# EAGLE board Pirxboard (EAGLE 6.4)
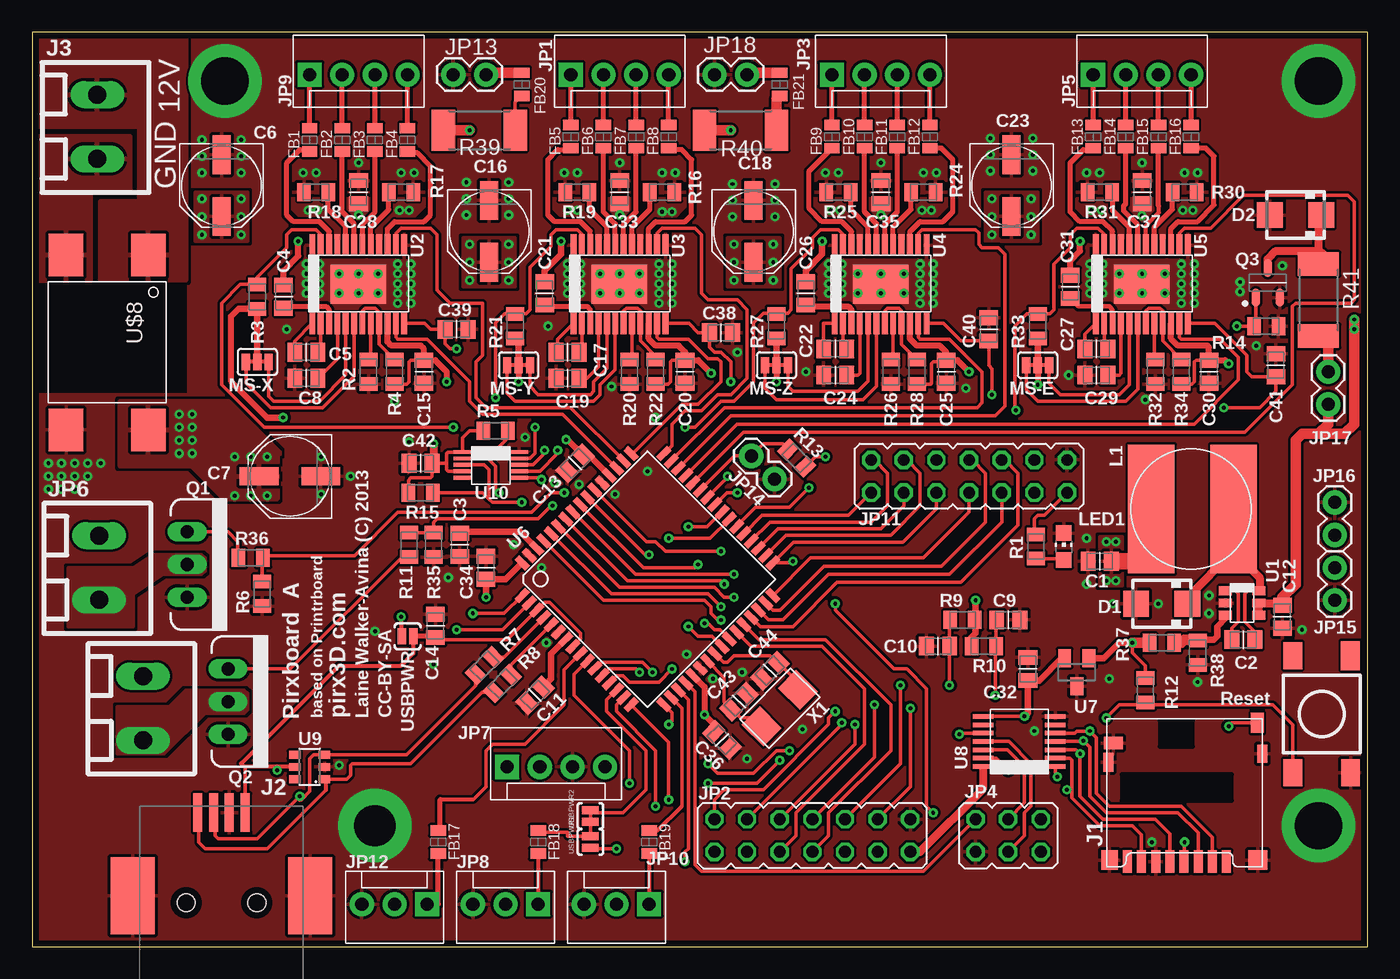
[diagram p1: board, top side]
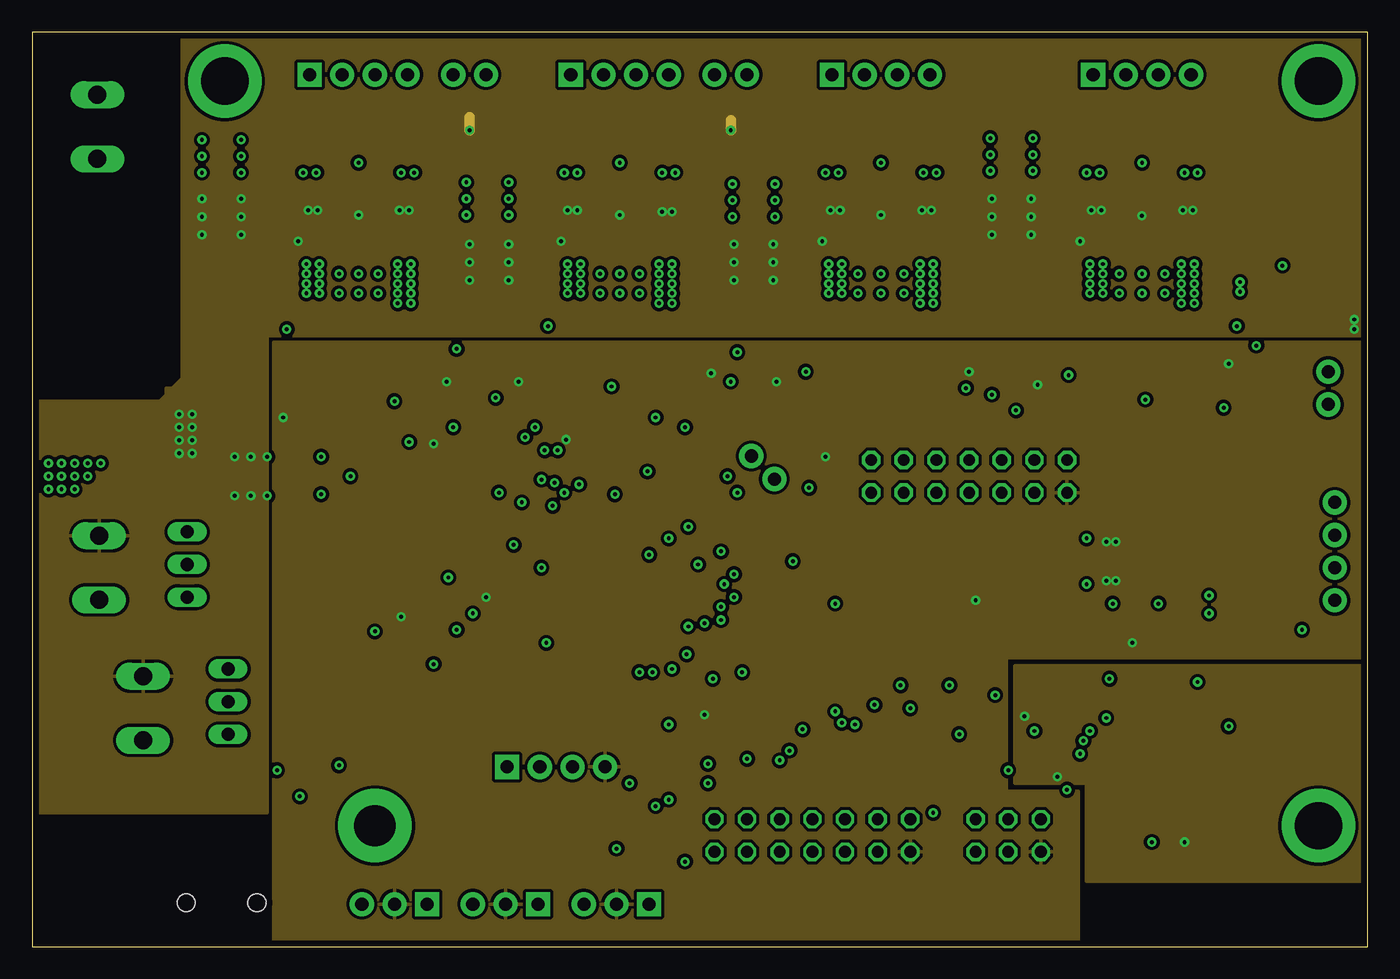
[diagram p2: board, inner layer PWR]
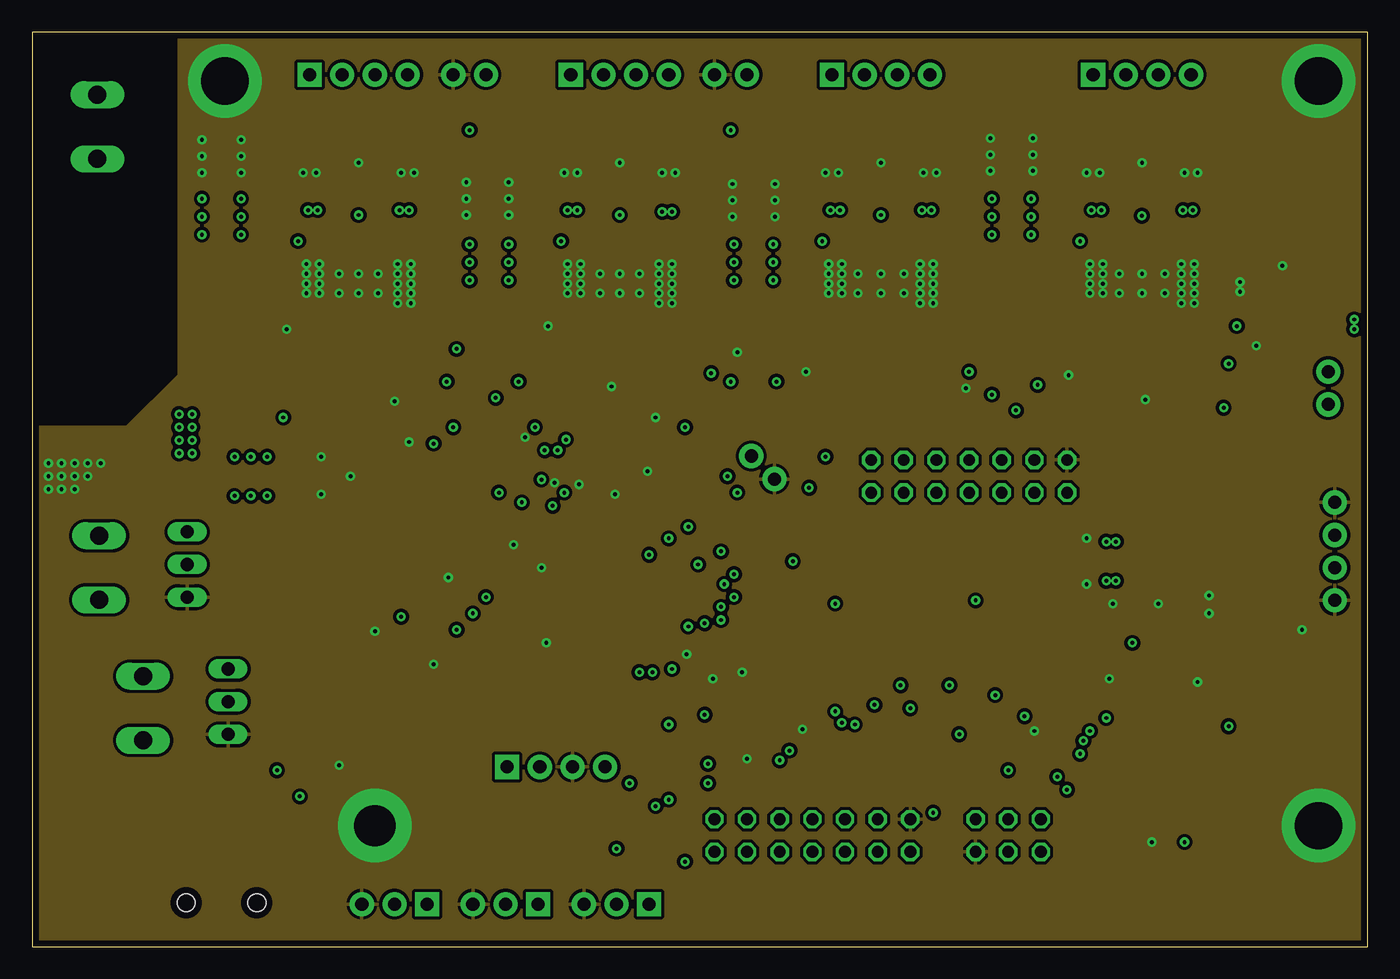
[diagram p3: board, inner layer GND]
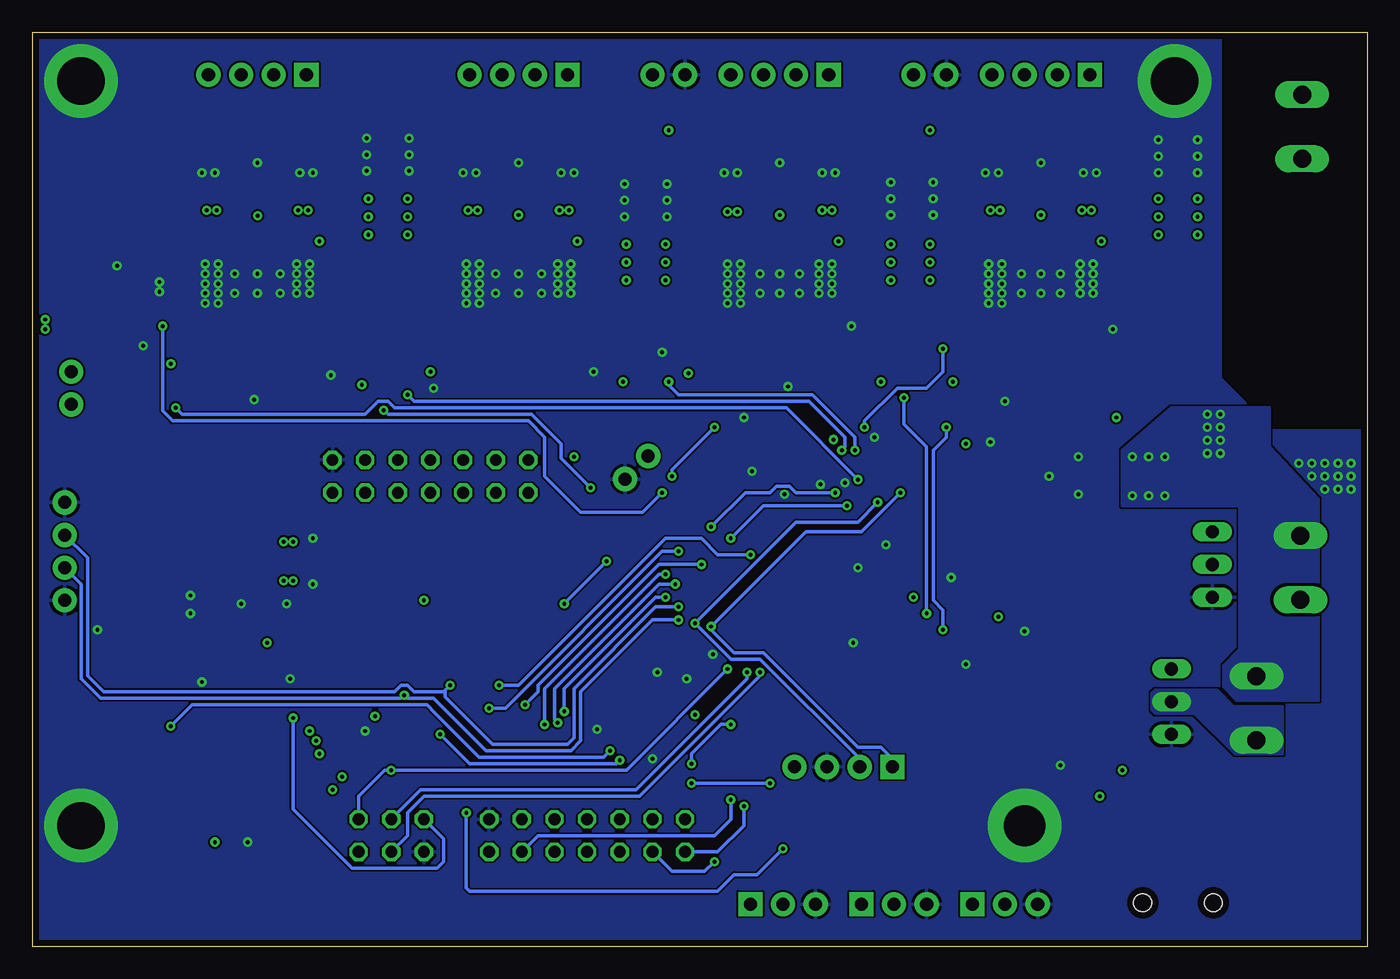
[diagram p4: board, bottom side, seen from below]

Size 103.89 x 71.12 mm. Coordinates in mm from the lower left corner, seen from the top.
Outline: 0,71.12 0,0 103.89,0 103.89,71.12 0,71.12
Copper layers (1*2+3*16): Top 0.035mm / dielectric 0.6mm / PWR 0.035mm / dielectric 0.2mm / GND 0.035mm / dielectric 0.6mm / Bottom 0.035mm
Design rules "default": minimum track width 6mil, minimum drill 12mil, track to track 6mil, track to pad 7mil, pad to pad 6mil, via to via 6mil, smd to smd 0mil, copper to edge 20mil, drill to drill 10mil, minimum pad ring 10mil, minimum via ring 8mil, stop-mask expansion 2mil, vias tented up to drill 100mil, thermal gap 10mil

## Footprints (pad centres in the part's own frame; a part is rotated, then mirrored left to right if it is on the bottom)
CAPC2012X145AN = smd 1.15 x 1.45: 1 -0.9,0; 2 0.9,0
PANASONIC_D = smd 3 x 1.4: + 2.4,0; - -2.4,0
SMA = smd 2 x 2: A 2,0; C -2,0
FB2012 = smd 0.8 x 1.2: P$1 -0.9,0; P$2 0.9,0
AMPHENOL-MICROSD = smd 0.7 x 1.75: 1 3.636,-5.842; 2 2.536,-5.842; 3 1.436,-5.842; 4 0.336,-5.842; 5 -0.764,-5.842; 6 -1.864,-5.842; 7 -2.964,-5.842; 8 -4.064,-5.842 | smd 1.29 x 1.5: C1 -5.464,-5.717 | smd 1.5 x 1.5: C2 6.086,-5.717 | smd 0.8 x 1.5: C3 -5.539,1.883 | smd 0.8 x 1.4: C4 6.436,2.533 | smd 1.5 x 1: CD1 -5.164,3.383 | smd 1 x 1.55: CD2 6.036,4.958
PHOENIX-5MM-2POS = drill 1.4 long: P$1 -2.5,0; P$2 2.5,0
MOLEX-1X4 = drill 1.016 pad 1.88 square: 1 0,0 | drill 1.016 pad 1.88: 2 2.54,0; 3 5.08,0; 4 7.62,0
JP7Q = drill 0.914 octagon: 1 -7.62,-1.27; 2 -7.62,1.27; 3 -5.08,-1.27; 4 -5.08,1.27; 5 -2.54,-1.27; 6 -2.54,1.27; 7 0,-1.27; 8 0,1.27; 9 2.54,-1.27; 10 2.54,1.27; 11 5.08,-1.27; 12 5.08,1.27; 13 7.62,-1.27; 14 7.62,1.27
JP3Q = drill 0.914 octagon: 1 -2.54,-1.27; 2 -2.54,1.27; 3 0,-1.27; 4 0,1.27; 5 2.54,-1.27; 6 2.54,1.27
MOLEX-1X3 = drill 1.016 pad 1.88 square: 1 0,0 | drill 1.016 pad 1.88: 2 2.54,0; 3 5.08,0
1X02 = drill 1.016 pad 1.88: 1 0,0; 2 2.54,0
SDR1006 = smd 10.008 x 3.607: P$1 0,3.048; P$2 0,-3.353
CHIP-LED0805 = smd 1.2 x 1.2: A 0,-1.05; C 0,1.05
SJ_3_CONNECTED = smd 0.635 x 1.27: 1 -0.889,0; 2 0,0; 3 0.889,0
TO220V = drill 1.016 long: 1 -2.54,0; 2 0,0; 3 2.54,0
SOT95P280X135-3N = smd 1.4 x 0.65: 1 -1.15,0.95; 2 -1.15,-0.95; 3 1.15,0
RESC2012X70N = smd 1.05 x 1.4: 1 -0.95,0; 2 0.95,0
R2512 = smd 1.8 x 3.2: 1 -2.8,0; 2 2.8,0
TACTILE_SWITCH_TALL = smd 2.1 x 1.45: A1 -4.55,-2.25; A2 4.55,-2.25; B2 4.55,2.25 | smd 2.25 x 1.45: B1 -4.55,2.225
TSOT6 = smd 0.69 x 1: 1 -1,-1.4; 2 -0.05,-1.4; 3 0.9,-1.4; 4 0.9,1.2; 5 -0.05,1.2; 6 -1,1.2
TSSOP-24 = smd 0.45 x 1.65: 1 -3.6,-3.1; 2 -2.95,-3.1; 3 -2.3,-3.1; 4 -1.65,-3.1; 5 -1,-3.1; 6 -0.35,-3.1; 7 0.3,-3.1; 8 0.95,-3.1; 9 1.6,-3.1; 10 2.25,-3.1; 11 2.9,-3.1; 12 3.55,-3.1; 13 3.55,3; 14 2.9,3; 15 2.25,3; 16 1.6,3; 17 0.95,3; 18 0.3,3; 19 -0.35,3; 20 -1,3; 21 -1.65,3; 22 -2.3,3; 23 -2.95,3; 24 -3.6,3 | smd 4.32 x 3: PAD -0.025,-0.05
TQFP64-2 = smd 1.194 x 0.508: 1 -7.8,6; 2 -7.8,5.2; 3 -7.8,4.4; 4 -7.8,3.6; 5 -7.8,2.8; 6 -7.8,2; 7 -7.8,1.2; 8 -7.8,0.4; 9 -7.8,-0.4; 10 -7.8,-1.2; 11 -7.8,-2; 12 -7.8,-2.8; 13 -7.8,-3.6; 14 -7.8,-4.4; 15 -7.8,-5.2; 16 -7.8,-6; 33 7.8,-6; 34 7.8,-5.2; 35 7.8,-4.4; 36 7.8,-3.6; 37 7.8,-2.8; 38 7.8,-2; 39 7.8,-1.2; 40 7.8,-0.4; 41 7.8,0.4; 42 7.8,1.2; 43 7.8,2; 44 7.8,2.8; 45 7.8,3.6; 46 7.8,4.4; 47 7.8,5.2; 48 7.8,6 | smd 0.508 x 1.194: 17 -6,-7.8; 18 -5.2,-7.8; 19 -4.4,-7.8; 20 -3.6,-7.8; 21 -2.8,-7.8; 22 -2,-7.8; 23 -1.2,-7.8; 24 -0.4,-7.8; 25 0.4,-7.8; 26 1.2,-7.8; 27 2,-7.8; 28 2.8,-7.8; 29 3.6,-7.8; 30 4.4,-7.8; 31 5.2,-7.8; 32 6,-7.8; 49 6,7.8; 50 5.2,7.8; 51 4.4,7.8; 52 3.6,7.8; 53 2.8,7.8; 54 2,7.8; 55 1.2,7.8; 56 0.4,7.8; 57 -0.4,7.8; 58 -1.2,7.8; 59 -2,7.8; 60 -2.8,7.8; 61 -3.6,7.8; 62 -4.4,7.8; 63 -5.2,7.8; 64 -6,7.8
SOT23C = smd 1 x 1.4: 1 -0.95,-1.1; 2 0.95,-1.1; 3 0,1.1
TSSOP14 = smd 0.35 x 1.6: 1 -2,-2.9; 2 -1.35,-2.9; 3 -0.7,-2.9; 4 -0.05,-2.9; 5 0.6,-2.9; 6 1.25,-2.9; 7 1.9,-2.9; 8 1.9,2.7; 9 1.25,2.7; 10 0.6,2.7; 11 -0.05,2.7; 12 -0.7,2.7; 13 -1.35,2.7; 14 -2,2.7
SOT23-6 = smd 0.6 x 0.9: 1 -0.95,-1.15; 2 0,-1.15; 3 0.95,-1.15; 4 0.95,1.15; 5 0,1.15; 6 -0.95,1.15
MSOP10 = smd 0.3 x 1.4: 1 -1,-2.2; 2 -0.5,-2.2; 3 0,-2.2; 4 0.5,-2.2; 5 1,-2.2; 6 1,2.2; 7 0.5,2.2; 8 0,2.2; 9 -0.5,2.2; 10 -1,2.2
ACM1513 = smd 3.3 x 2.7: P$1 -6.8,3.2; P$2 -6.8,-3.2; P$3 6.8,-3.2; P$4 6.8,3.2
TECONECTIVITYUSBBSMT = smd 3 x 0.7: + -16,1.85; - -16,0.6; D+ -16,-1.85; D- -16,-0.6 | smd 6 x 3.4: P$5 -9.55,6.9; P$6 -9.55,-6.9 | hole 1.4: -9,2.75; -9,-2.75
SJ_2S-NO = smd 0.635 x 1.27: 1 -0.45,0; 2 0.45,0
NDK-XTAL = smd 2 x 2.4: P$1 -2,0; P$2 2,0

## Placement (x,y rotation side)
C1  22uF  [CAPC2012X145AN]  83.06,29.97 180 top
C2  0.22uF  [CAPC2012X145AN]  94.23,23.88 180 top
C3  0.1uF  [CAPC2012X145AN]  33.27,31.24 270 top
C4  0.1uF  [CAPC2012X145AN]  19.56,50.55 270 top
C5  0.1uF  [CAPC2012X145AN]  21.34,46.23 180 top
C6  100uF  [PANASONIC_D]  14.73,59.18 270 top
C7  100uF  [PANASONIC_D]  20.07,36.58 180 top
C8  0.22uF  [CAPC2012X145AN]  21.34,44.2 0 top
C9  10uF  [CAPC2012X145AN]  75.95,25.4 180 top
C10  10uF  [CAPC2012X145AN]  70.48,23.37 0 top
C11  1uF  [CAPC2012X145AN]  39.12,19.56 45 top
C12  1uF  [CAPC2012X145AN]  97.28,25.65 270 top
C13  0.1uF  [CAPC2012X145AN]  42.24,37.59 45 top
C14  0.1uF  [CAPC2012X145AN]  31.37,24.95 90 top
C15  10uF  [CAPC2012X145AN]  30.48,44.7 90 top
C16  100uF  [PANASONIC_D]  35.56,55.63 270 top
C17  0.1uF  [CAPC2012X145AN]  41.66,46.23 180 top
C18  100uF  [PANASONIC_D]  56.13,55.63 270 top
C19  0.22uF  [CAPC2012X145AN]  41.66,44.2 0 top
C20  10uF  [CAPC2012X145AN]  50.8,44.7 90 top
C21  0.1uF  [CAPC2012X145AN]  39.88,50.8 270 top
C22  0.1uF  [CAPC2012X145AN]  62.48,46.48 180 top
C23  100uF  [PANASONIC_D]  76.2,59.18 270 top
C24  0.22uF  [CAPC2012X145AN]  62.48,44.45 0 top
C25  10uF  [CAPC2012X145AN]  71.12,44.7 90 top
C26  0.1uF  [CAPC2012X145AN]  60.2,50.8 270 top
C27  0.1uF  [CAPC2012X145AN]  82.8,46.48 180 top
C28  0.1uF  [CAPC2012X145AN]  25.4,58.67 90 top
C29  0.22uF  [CAPC2012X145AN]  82.8,44.45 0 top
C30  10uF  [CAPC2012X145AN]  91.57,44.7 90 top
C31  0.1uF  [CAPC2012X145AN]  80.77,51.31 270 top
C32  10uF  [CAPC2012X145AN]  77.47,21.59 90 top
C33  0.1uF  [CAPC2012X145AN]  45.72,58.67 90 top
C34  0.1uF  [CAPC2012X145AN]  35.31,29.46 270 top
C35  0.1uF  [CAPC2012X145AN]  66.04,58.67 90 top
C36  0.1uF  [CAPC2012X145AN]  53.67,16.08 135 top
C37  0.1uF  [CAPC2012X145AN]  86.36,58.67 90 top
C38  0.1uF  [CAPC2012X145AN]  53.59,47.75 0 top
C39  0.1uF  [CAPC2012X145AN]  33.02,48.01 0 top
C40  0.1uF  [CAPC2012X145AN]  74.42,48.01 90 top
C41  0.1uF  [CAPC2012X145AN]  96.77,45.21 90 top
C42  0.1uF  [CAPC2012X145AN]  30.23,37.59 0 top
C43  10pF  [CAPC2012X145AN]  54.99,19.05 225 top
C44  10pF  [CAPC2012X145AN]  57.4,21.46 45 top
D1  [SMA]  87.88,26.67 180 top
D2  [SMA]  98.3,56.9 180 top
FB1  MPZ2012  [FB2012]  21.59,62.74 90 top
FB2  MPZ2012  [FB2012]  24.13,62.74 90 top
FB3  MPZ2012  [FB2012]  26.67,62.74 90 top
FB4  MPZ2012  [FB2012]  29.21,62.74 90 top
FB5  MPZ2012  [FB2012]  41.91,62.99 90 top
FB6  MPZ2012  [FB2012]  44.45,62.99 90 top
FB7  MPZ2012  [FB2012]  46.99,62.99 90 top
FB8  MPZ2012  [FB2012]  49.53,62.99 90 top
FB9  MPZ2012  [FB2012]  62.23,62.99 90 top
FB10  MPZ2012  [FB2012]  64.77,62.99 90 top
FB11  MPZ2012  [FB2012]  67.31,62.99 90 top
FB12  MPZ2012  [FB2012]  69.85,62.99 90 top
FB13  MPZ2012  [FB2012]  82.55,62.99 90 top
FB14  MPZ2012  [FB2012]  85.09,62.99 90 top
FB15  MPZ2012  [FB2012]  87.63,62.99 90 top
FB16  MPZ2012  [FB2012]  90.17,62.99 90 top
FB17  MPZ2012  [FB2012]  31.6,8.13 270 top
FB18  MPZ2012  [FB2012]  39.37,8.13 270 top
FB19  MPZ2012  [FB2012]  48.01,8.13 270 top
FB20  MPZ2012  [FB2012]  38.1,67.06 90 top
FB21  MPZ2012  [FB2012]  58.17,67.06 90 top
J1  MICROSD  [AMPHENOL-MICROSD]  89.28,12.45 0 top
J2  [PHOENIX-5MM-2POS]  8.64,18.54 270 top
J3  [PHOENIX-5MM-2POS]  5.08,63.75 270 top
JP1  MOT-Y  [MOLEX-1X4]  41.91,67.82 0 top
JP2  EXP1  [JP7Q]  60.71,8.64 0 top
JP3  MOT-Z  [MOLEX-1X4]  62.23,67.82 0 top
JP4  ICSP  [JP3Q]  75.95,8.64 0 top
JP5  MOT-E  [MOLEX-1X4]  82.55,67.82 0 top
JP6  [PHOENIX-5MM-2POS]  5.21,29.46 270 top
JP7  I2C  [MOLEX-1X4]  36.96,13.97 0 top
JP8  Y-STOP  [MOLEX-1X3]  39.37,3.3 180 top
JP9  MOT-X  [MOLEX-1X4]  21.59,67.82 0 top
JP10  Z-STOP  [MOLEX-1X3]  48.01,3.3 180 top
JP11  EXP2  [JP7Q]  72.9,36.58 180 top
JP12  X-STOP  [MOLEX-1X3]  30.73,3.3 180 top
JP13  LED  [1X02]  35.31,67.82 180 top
JP14  BOOT  [1X02]  57.75,36.36 135 top
JP15  B-THERM  [1X02]  101.35,29.46 270 top
JP16  E-THERM  [1X02]  101.35,32 90 top
JP17  FAN  [1X02]  100.84,42.16 90 top
JP18  EFAN  [1X02]  55.63,67.82 180 top
L1  47uH  [SDR1006]  90.42,34.04 270 top
LED1  PWR  [CHIP-LED0805]  80.26,31.12 0 top
MS-E  [SJ_3_CONNECTED]  78.23,45.21 180 top
MS-X  [SJ_3_CONNECTED]  17.53,45.47 180 top
MS-Y  [SJ_3_CONNECTED]  37.85,45.21 180 top
MS-Z  [SJ_3_CONNECTED]  57.91,45.21 180 top
Q1  RFP30N06LE  [TO220V]  12.07,29.72 270 top
Q2  RFP30N06LE  [TO220V]  15.24,19.05 270 top
Q3  RFP30N06LE  [SOT95P280X135-3N]  96.14,51.63 90 top
R1  330  [RESC2012X70N]  78.11,31.12 90 top
R2  10k  [RESC2012X70N]  26.16,44.7 270 top
R3  100k  [RESC2012X70N]  17.53,50.55 90 top
R4  100k  [RESC2012X70N]  28.19,44.7 90 top
R5  4.7k  [RESC2012X70N]  36.07,40.13 180 top
R6  100k  [RESC2012X70N]  17.91,27.43 270 top
R7  22  [RESC2012X70N]  35.18,21.84 45 top
R8  22  [RESC2012X70N]  36.58,20.45 45 top
R9  4.7k  [RESC2012X70N]  72.39,25.4 0 top
R10  4.7k  [RESC2012X70N]  74.04,23.37 180 top
R11  47r  [RESC2012X70N]  29.34,31.24 270 top
R12  100k  [RESC2012X70N]  86.61,19.94 90 top
R13  100k  [RESC2012X70N]  59.48,37.99 315 top
R14  100k  [RESC2012X70N]  96.01,48.26 0 top
R15  4.7k  [RESC2012X70N]  30.23,35.31 180 top
R16  0.11  [RESC2012X70N]  49.02,58.67 0 top
R17  0.11  [RESC2012X70N]  28.7,58.67 0 top
R18  0.11  [RESC2012X70N]  22.1,58.67 180 top
R19  0.11  [RESC2012X70N]  42.42,58.67 180 top
R20  10k  [RESC2012X70N]  46.48,44.7 270 top
R21  100k  [RESC2012X70N]  37.59,48.26 90 top
R22  100k  [RESC2012X70N]  48.51,44.7 90 top
R24  0.11  [RESC2012X70N]  69.34,58.67 0 top
R25  0.11  [RESC2012X70N]  62.74,58.67 180 top
R26  10k  [RESC2012X70N]  66.8,44.7 270 top
R27  100k  [RESC2012X70N]  57.91,48.26 90 top
R28  100k  [RESC2012X70N]  68.83,44.7 90 top
R30  0.11  [RESC2012X70N]  89.66,58.67 0 top
R31  0.11  [RESC2012X70N]  83.06,58.67 180 top
R32  10k  [RESC2012X70N]  87.38,44.7 270 top
R33  100k  [RESC2012X70N]  78.23,48.26 90 top
R34  100k  [RESC2012X70N]  89.41,44.7 90 top
R35  100k  [RESC2012X70N]  31.24,31.24 270 top
R36  100  [RESC2012X70N]  17.02,30.23 180 top
R37  5.6k  [RESC2012X70N]  87.88,23.62 0 top
R38  1k  [RESC2012X70N]  90.68,22.86 270 top
R39  47r  [R2512]  34.8,63.5 0 top
R40  45r  [R2512]  55.12,63.5 0 top
R41  10  [R2512]  100.08,50.29 270 top
S1  Reset  [TACTILE_SWITCH_TALL]  100.33,18.08 270 top
U1  LM2841  [TSOT6]  94.23,26.67 270 top
U2  A4982  [TSSOP-24]  25.4,51.56 0 top
U3  A4982  [TSSOP-24]  45.72,51.56 0 top
U4  A4982  [TSSOP-24]  66.04,51.56 0 top
U5  A4982  [TSSOP-24]  86.36,51.56 0 top
U6  AT90USB1286  [TQFP64-2]  47.88,28.58 45 top
U7  AP7313  [SOT23C]  81.28,21.34 180 top
U8  TXB0104  [TSSOP14]  76.71,16 90 top
U9  PRTR5V0U4D  [SOT23-6]  21.59,13.97 90 top
U10  MCP4728  [MSOP10]  35.69,37.46 270 top
U$8  ACM1513-551-2PLACM1513  [ACM1513]  5.84,46.99 270 top
U$12  USB_B_SMT_TECONNECTIVITY  [TECONECTIVITYUSBBSMT]  14.73,-5.59 270 top
USBPWR  [SJ_2S-NO]  29.21,24.13 180 top
USBPWR1  [SJ_2S-NO]  43.43,8.13 90 top
USBPWR2  [SJ_2S-NO]  43.43,10.16 90 top
X1  16MHz  [NDK-XTAL]  58.17,18.54 225 top

## Tracks (layer width: path | path; a pad name or v marks a point on that pad's centre or on a via)
12V  (via drill 0.3, 0.3 pad 0.41)
  Top 0.254: 97.28,26.42 C12.1 97.28,26.67
  Top 0.457: C4.1 19.56,52.58 20.7,53.72 v20.7,54.86 | C31.1 80.77,53.34 81.53,54.1 v81.53,54.86
  Top 0.508: C31.1 80.38,52.21 | 40.25,51.7 C21.1 39.88,52.58 41.15,53.85 v41.15,54.86 | v61.47,54.86 61.47,53.85 60.2,52.58 C26.1
  Top 0.61: U1.4 U1.5 97.11,26.72 C12.1
  Top 0.813: v102.87,48.77 102.87,40.64 102.11,39.88 100.08,39.88 | C12.1 97.28,26.67 97.28,27.18 98.3,28.19 98.3,39.37 98.81,39.88 100.08,39.88 | JP17.1 100.84,40.64 100.08,39.88 | R39.1 v34.04,63.5 | R40.1 v54.36,63.5
  PWR 0.813: v34.04,63.5 34.04,64.52 | v54.36,63.5 54.36,64.26
  other vias: 21.46,57.28 29.34,57.28 41.66,57.28 49.78,57.15 69.98,57.28 86.33,56.85 90.3,57.28 66.04,56.9 45.72,56.9 25.4,56.9 62.1,57.28 82.42,57.28 77.72,58.17 77.72,56.77 77.72,55.37 74.68,58.17 74.68,56.77 74.68,55.37 16.26,58.17 16.26,56.77 16.26,55.37 13.21,58.17 13.21,56.77 13.21,55.37 57.66,54.61 57.66,53.21 57.66,51.82 54.61,54.61 54.61,53.21 54.61,51.82 37.08,54.61 37.08,53.21 37.08,51.82 34.04,54.61 34.04,53.21 34.04,51.82 49.02,57.15 42.42,57.28 22.22,57.28 28.57,57.28 62.87,57.28 69.22,57.28 83.19,57.28 89.53,57.28 102.87,48.01 18.29,38.1 17.02,38.1 15.75,38.1 17.02,35.05 18.29,35.05 15.75,35.05 11.43,41.4 11.43,40.39 11.43,39.37 11.43,38.35 12.45,41.4 12.45,40.39 12.45,39.37 12.45,38.35
  pour Bottom (isolate 0.254, no thermals): 9.91,34.29 19.05,34.29 19.05,38.61 15.24,41.91 7.62,41.91 7.62,38.86 3.81,34.8 3.81,34.8 3.81,19.18 10.16,19.18 11.18,20.19 11.18,21.84 9.91,23.11
  pour PWR (isolate 0.254, rank 6): 103.89,47.5 18.29,47.5 18.29,10.41 0,10.41 0,28.45 0.25,27.43 0.25,42.42 9.91,42.42 11.68,44.2 11.68,71.12 103.89,71.12
  pour Top (no thermals): 82.55,55.12 90.42,55.12 90.42,56.39 91.69,57.66 91.69,58.17 81.28,58.17 81.28,57.4 82.55,56.13
  pour Top (isolate 0.254): 74.42,58.67 78.23,58.67 78.23,54.86 74.17,54.86 74.17,58.67
  pour Top (no thermals): 62.1,55.12 69.98,55.12 69.98,56.39 71.25,57.66 71.25,58.17 60.83,58.17 60.83,57.4 62.1,56.13
  pour Top (no thermals): 41.78,55.12 49.66,55.12 49.66,56.39 50.93,57.66 50.93,58.17 40.51,58.17 40.51,57.4 41.78,56.13
  pour Top (no thermals): 21.46,55.12 29.34,55.12 29.34,56.39 30.61,57.66 30.61,58.17 20.19,58.17 20.19,57.4 21.46,56.13
  pour Top: 12.95,58.67 16.76,58.67 16.76,54.86 12.7,54.86 12.7,58.67
  pour Top (isolate 0.254): 54.1,55.12 58.17,55.12 58.17,51.31 54.1,51.31
  pour Top (isolate 0.254): 33.53,55.12 37.59,55.12 37.59,51.31 33.53,51.31
  pour PWR (isolate 0.254, no thermals): 13.46,43.43 10.41,43.43 10.41,41.66 13.46,41.66
  pour Top: 19.05,34.8 14.99,34.8 12.45,37.34 6.86,37.34 6.86,42.42 15.24,42.42 19.3,38.35 19.05,38.35
!E-ENABLE  (via drill 0.3)
  Top 0.254: v60.45,35.69 58.93,34.16 56.3,34.16 | U5.23 83.41,55.4 82.93,55.88 81.28,55.88 80.77,55.37 80.77,54.36 79.5,53.09 79.5,49.53 79.18,49.21 R33.2 77.4,49.21 76.45,48.26 76.45,41.61 v76.55,41.7 | U6.38 56.3,34.16 | 56.3,34.16
  Bottom 0.254: v60.45,35.69 62.74,37.97 62.74,39.12 65.02,41.4 76.2,41.4 76.5,41.7 v76.55,41.7
!HOTBED  (via drill 0.3)
  Top 0.254: v49.53,31.75 52.75,31.75 U6.39 | R11.1 R35.1 31.24,33.02 31.5,33.27 39.37,33.27 40.38,34.28 v40.5,34.28
  Bottom 0.254: v40.5,34.28 47,34.28 v49.53,31.75
!HOTEND  (via drill 0.3)
  Top 0.254: v51.05,32.64 52.51,32.64 | U6.40 52.51,32.64 | 52.51,32.64 | v41.4,35.31 40.39,35.31 38.86,33.78 28.45,33.78 25.08,30.41 17.97,30.41 R36.1 17.91,30.29 | R6.1 17.91,30.29 | 18.03,30.48 17.91,30.35 17.91,30.29
  Bottom 0.254: v51.05,32.64 48.39,35.31 46.48,35.31 45.97,35.81 44.96,35.81 44.45,35.31 v41.4,35.31
!PWM-FAN  (via drill 0.3)
  Top 0.254: U6.41 | Q3.1 95.19,48.39 R14.1 v93.73,48.26 | U6.41 54.04,35.31 v54.86,35.31
  Bottom 0.254: v93.73,48.26 93.73,41.66 92.96,40.89 65.28,40.89 64.01,39.62 64.01,36.58 61.21,33.78 56.39,33.78 v54.86,35.31
!RESET  (via drill 0.3)
  Top 0.254: 86.61,18.8 84.58,18.8 v83.57,17.78 | 86.61,18.8 96.52,18.8 98.08,17.24 S1.A2 | 86.61,18.8 R12.1 | U6.20 | U6.20 51.56,19.8 51.56,6.35 52.07,5.84 69.34,5.84 JP4.2
  Bottom 0.254: v83.57,17.78 83.57,10.67 78.99,6.1 72.39,6.1 71.88,6.6 71.88,8.38 JP4.2
!X-ENABLE  (via drill 0.3)
  Top 0.254: U2.23 22.45,55.4 22.1,55.75 20.19,55.75 19.81,55.37 19.81,54.36 17.53,52.07 R3.2 16.19,51.5 14.73,50.04 14.73,43.69 18.03,40.39 v32.77,40.39 | v33.02,24.64 36.59,24.64 | U6.2 36.59,24.64 | 36.59,24.64
  Bottom 0.254: v33.02,24.64 33.02,26.16 33.78,26.92 33.78,38.61 32.77,39.62 v32.77,40.39
!Y-ENABLE  (via drill 0.3)
  Top 0.254: U3.23 42.77,55.4 42.42,55.75 40.77,55.75 40.39,55.37 40.39,54.48 38.73,52.83 38.73,49.53 38.41,49.21 R21.2 36.76,49.21 36.07,48.51 v36.07,42.67 | v34.29,25.91 36.73,25.91 U6.1
  Bottom 0.254: v34.29,25.91 34.29,38.86 36.07,40.64 v36.07,42.67
!Z-ENABLE  (via drill 0.3)
  Top 0.254: U4.23 63.09,55.4 62.74,55.75 61.34,55.75 60.71,55.12 60.71,54.36 59.05,52.7 59.05,49.53 58.8,49.28 57.85,49.28 | 57.85,49.28 56.9,49.28 56.13,48.51 56.13,43.94 54.61,42.42 53.59,42.42 51.56,40.39 v50.8,40.39 | 57.85,49.28 R27.2 | U6.42 54.1,36.49 v54.1,36.58
  Bottom 0.254: v50.8,40.39 54.1,37.08 v54.1,36.58
+3V3  (via drill 0.3)
  Top 0.254: U8.1 79.61,13.36 v79.76,13.21 | U8.8 v77.22,17.91 | v89.66,8.13 89.66,6.69 89.62,6.64 J1.4
  Top 0.508: U7.2 80.09,22.44 78.35,20.69 C32.1 77.47,18.16 v77.22,17.91
  pour PWR (isolate 0.254): 103.89,21.84 76.45,21.84 76.45,12.7 82.04,12.7 82.04,5.08 103.89,5.08
+5V  (via drill 0.3)
  Top 0.254: R4.1 29.15,43.75 29.34,43.94 29.34,45.47 29.46,45.59 30.47,45.59 C15.2 | R22.1 49.47,43.75 49.66,43.94 49.66,45.47 49.8,45.6 C20.2 | C25.2 70.98,45.47 70.1,45.47 69.98,45.34 69.98,43.81 69.92,43.75 R28.1 | R34.1 90.24,43.75 90.42,43.94 90.42,45.47 90.56,45.6 C30.2 | R12.2 86.61,21.84 85.6,22.86 v85.6,23.62 | R13.2 60.94,38.1 v61.72,38.1 | 53.14,17.22 53.14,17.07 53.09,17.02 | U10.4 32.38,36.97 32.26,37.08 32.26,37.59 | 32.26,37.59 32.26,38.35 32.37,38.46 U10.1 33.49,39.58 34.04,40.13 R5.2 | 32.26,37.59 C42.2 31.11,37.58 31.11,36.58 30.99,36.45 29.46,36.45 29.28,36.26 R15.2 | U8.14 74.01,13.82 | R1.2 77.98,32.19 77.98,33.27 78.23,33.53 78.74,33.53 JP11.2
  Top 0.305: USBPWR.2 28.76,25.6 v28.7,25.65
  Top 0.406: 53.09,17.02 53.03,17.02 C36.2
  Top 0.457: U2.10 27.65,47.03 27.94,46.74 30.23,46.74 30.48,46.48 C15.2 31.36,45.6 32.26,44.7 v32.26,43.94 | 18.29,41.15 15.49,43.94 15.49,49.02 | U3.10 47.97,47.28 48.51,46.74 50.29,46.74 50.8,46.23 C20.2 51.82,45.6 v52.83,44.59 | MS-Y.2 v37.85,43.94 | U4.10 68.29,47.28 68.83,46.74 70.61,46.74 71.12,46.23 C25.2 72,45.6 v72.9,44.7 | MS-Z.2 v57.91,43.94 | U5.10 88.61,47.28 89.15,46.74 91.44,46.74 91.57,46.61 C30.2 92.83,45.6 v93.09,45.34 | MS-E.2 v78.23,43.69 | U6.21 52.32,20.17 v52.32,18.03 53.14,17.22
  Top 0.508: 15.49,49.02 16.07,49.6 R3.1 MS-X.2 | 18.29,41.15 v19.54,41.15 | MS-Y.2 37.85,47.06 R21.1 | MS-Z.2 R27.1 | MS-E.2 R33.1 | R10.2 73.09,24.07 73.41,24.38 73.41,25.33 R9.2 73.41,25.47 v73.41,26.92 | U7.1 83.4,22.44 84.58,23.62 v85.6,23.62 | U6.64 36.84,28.56 C34.2 v35.31,27.18 | U6.52 43.32,38.23 C13.2 | v41.53,39.43 41.67,39.43 C13.2 | C13.2 42.8,38.23
  Top 0.61: v31.24,39.12 31.24,37.71 C42.2 | JP2.13 69.09,7.37 74.01,12.29 74.01,13.82
  Top 0.813: v85.6,23.62 R37.1
  Top 1.27: C1.1 86.61,29.97 87.12,30.48 87.12,33.98 L1.P$2
  other vias: 83.57,31.5 84.33,31.5 83.57,28.45 84.33,28.45
  pour PWR (isolate 0.254): 103.89,46.99 18.8,46.99 18.8,0 81.41,0 81.41,12.07 75.82,12.07 75.82,22.48 103.89,22.48
  pour Top (isolate 0.254): 84.84,28.07 84.84,31.88 83.06,31.88 83.06,28.07
A2  (via drill 0.3)
  Top 0.254: U6.59 45.69,27.94 53.09,27.94 53.85,27.18 v54.61,27.18 | JP2.2 53.09,11.43 53.85,12.19 56.9,12.19 61.98,17.27 61.98,17.78 v62.48,18.29
  Bottom 0.254: v62.48,18.29 62.48,20.07 55.37,27.18 v54.61,27.18
A3  (via drill 0.3)
  Top 0.254: U6.58 46.31,28.45 53.59,28.45 v53.85,28.19 | JP2.4 62.99,17.27 v62.99,17.4
  Bottom 0.254: v62.99,17.4 63.25,17.65 63.25,20.07 55.12,28.19 v53.85,28.19
ALE
  Top 0.254: U6.43 54.63,38.16 JP14.2 55.95,38.17 56.9,39.12 58.42,39.12 58.93,38.61 58.86,38.61 R13.1
AREF
  Top 0.508: C3.1 33.39,32.26 37.97,32.26 U6.62
B-THERM  (via drill 0.3)
  Top 0.254: v74.93,19.56 74.93,23.31 R10.1 74.99,25.34 C9.2 | U6.61 44.44,26.92 52.32,26.92 52.83,26.42 52.83,25.91 53.34,25.4 v53.59,25.4
  Bottom 0.254: JP15.1 100.08,28.19 100.08,20.83 98.55,19.3 75.18,19.3 v74.93,19.56 74.68,19.3 72.64,19.3 68.58,15.24 61.98,15.24 61.21,16 61.21,19.81 55.63,25.4 v53.59,25.4
E-DIR
  Top 0.254: U5.14 89.26,55.48 89.66,55.88 91.69,55.88 94.23,58.42 102.36,58.42 102.87,57.91 102.87,50.29 102.62,50.04 98.3,50.04 98.04,49.78 98.04,43.69 94.36,40 55.35,40 U6.44
E-STEP
  Top 0.254: U5.11 89.26,47.39 89.41,47.24 92.46,47.24 93.85,45.85 93.85,44.07 90.42,40.64 54.85,40.64 U6.45
E-THERM  (via drill 0.3)
  Top 0.254: v71.37,20.32 71.37,23.36 C10.2 71.39,25.34 R9.1 | U6.60 45.06,27.43 52.58,27.43 v53.59,26.42
  Bottom 0.254: JP16.1 99.57,30.23 99.57,21.08 98.3,19.81 75.69,19.81 75.18,20.32 74.68,20.32 74.17,19.81 71.75,19.81 | v71.37,20.32 71.75,19.94 71.75,19.81 | 71.75,19.81 71.75,19.43 68.07,15.75 62.23,15.75 61.72,16.26 61.72,20.07 55.37,26.42 v53.59,26.42
GND  (via drill 0.3, 3.2 pad 5.71, 3.68 pad 5.71)
  other vias: 40.01,23.62 29.34,39.24 26.67,24.51 32.38,28.7 100.08,9.4 26.67,9.4 14.99,67.31 100.08,67.31 21.08,60.2 29.72,60.2 23.88,52.32 25.4,52.32 26.92,52.32 23.88,50.8 25.4,50.8 26.92,50.8 41.4,60.2 50.04,60.2 82.04,60.2 83.06,60.2 89.66,60.2 90.68,60.2 61.72,60.2 62.74,60.2 69.34,60.2 70.36,60.2 42.42,60.2 49.02,60.2 22.1,60.2 28.7,60.2 44.2,52.32 45.72,52.32 47.24,52.32 47.24,50.8 45.72,50.8 44.2,50.8 61.98,52.32 61.98,51.56 62.99,53.09 62.99,52.32 69.09,52.32 62.99,51.56 83.31,53.09 89.41,52.32 89.41,53.09 83.31,52.32 83.31,51.56 89.41,51.56 19.81,48.01 13.21,61.47 13.21,62.74 16.26,61.47 33.78,56.9 33.78,59.44 33.78,58.17 80.64,44.45 86.61,42.55 40.13,48.26 60.2,44.7 72.64,43.43 48.51,41.15 28.19,42.42 59.94,16.89 50.93,22.73 45.34,35.18 39.62,29.46 16.26,62.74 37.08,59.44 37.08,58.17 37.08,56.9 54.48,56.77 74.55,62.86 13.21,60.2 16.26,60.2 54.48,59.31 54.48,58.04 57.79,59.31 57.79,58.04 57.79,56.77 74.55,61.59 74.55,60.32 77.85,62.86 77.85,61.59 77.85,60.32 97.28,52.96 86.36,60.96 82.3,52.32 82.3,53.09 90.42,53.09 90.42,52.32 66.04,60.96 45.72,60.96 69.09,51.56 69.09,50.8 70.1,51.56 70.1,52.32 70.1,50.8 90.42,51.56 61.98,53.09 69.09,50.04 70.1,50.04 69.09,53.09 70.1,53.09 61.98,50.8 62.99,50.8 25.4,60.96 64.26,52.32 66.04,52.32 67.82,52.32 67.82,50.8 66.04,50.8 64.26,50.8 84.58,52.32 84.58,50.8 86.36,50.8 88.14,50.8 88.14,52.32 86.36,52.32 82.3,51.56 82.3,50.8 83.31,50.8 89.41,50.8 89.41,50.04 90.42,50.8 90.42,50.04 41.66,52.32 41.66,51.56 42.67,53.09 42.67,52.32 42.67,51.56 41.66,53.09 41.66,50.8 42.67,50.8 48.77,53.09 48.77,52.32 48.77,51.56 48.77,50.8 48.77,50.04 49.78,50.04 49.78,50.8 49.78,51.56 49.78,52.32 49.78,53.09 22.35,53.09 21.34,53.09 21.34,52.32 21.34,51.56 21.34,50.8 22.35,50.8 22.35,51.56 22.35,52.32 28.45,53.09 29.46,53.09 29.46,52.32 29.46,51.56 29.46,50.8 29.46,50.04 28.45,50.04 28.45,50.8 28.45,51.56 28.45,52.32 31.24,21.97 23.88,14.1 52.96,20.83 87.12,8.13 77.98,16.76 91.57,25.91 91.57,27.3 84.07,26.67 87.63,26.67 90.68,20.57 98.81,24.64 83.82,20.83 37.47,31.24 55.63,14.61 82.04,31.75 82.04,28.19 95.25,46.74 54.86,46.23 45.09,43.56 42.55,35.94 47.88,36.96 38.35,39.62 40.64,36.07 55.25,21.34 22.48,38.1 22.48,35.18 24.76,36.58 93.98,51.69 93.98,50.93 1.27,37.59 2.29,37.59 3.3,37.59 4.32,37.59 1.27,36.58 2.29,36.58 3.3,36.58 4.32,36.58 1.27,35.56 2.29,35.56 3.3,35.56 5.33,37.59
  pour Top (isolate 0.203, rank 6): 12.19,71.12 103.89,71.12 103.89,0 0.51,0 0.51,42.93 12.19,42.93
  pour Bottom (rank 6): 11.43,71.12 103.89,71.12 103.89,0 0,0 0,40.13 7.37,40.13 11.43,44.2
  pour GND (isolate 0.254): 103.89,71.12 103.89,0 0,0 0,40.39 7.37,40.39 11.43,44.45 11.43,71.12
HOTBED-GND
  pour Top (isolate 0.254, no thermals): 11.94,19.94 16.51,19.94 16.76,19.69 16.76,18.41 16.51,18.16 13.46,18.16 10.29,14.99 6.6,14.99 6.6,18.67 10.67,18.67
  pour Bottom (isolate 0.254, no thermals): 6.6,18.67 10.41,18.67 11.68,19.94 16.51,19.94 16.76,19.69 16.76,18.41 16.51,18.16 13.46,18.16 10.29,14.99 6.6,14.99
HOTEND-GND
  pour Top (isolate 0.254, no thermals): 9.4,30.48 13.21,30.48 13.46,30.23 13.46,29.21 13.21,28.96 10.16,28.96 7.87,27.43 7.87,24.89 2.79,24.89 2.79,29.46 7.87,29.46
MCU_DN  (via drill 0.3)
  Top 0.254: R7.1 34.51,20.28 29.14,14.92 U9.3 21.9,14.92 21.59,14.61 21.59,12.07 20.95,11.43 20.83,11.43 | v20.83,11.68 17.53,8.38 14.48,8.38 14.22,8.64 14.22,10.32 U$12.D-
  Top 0.406: v20.83,11.68 20.83,11.43
MCU_DP
  Top 0.254: U9.1 24.45,13.02 24.76,13.34 24.76,14.1 24.89,14.22 29.46,14.22 35.02,19.77 R8.1 | 22.86,12.19 18.29,7.62 13.46,7.62 12.95,8.13 12.95,10.34 U$12.D+
  Top 0.305: 22.86,12.19 22.86,12.9 U9.1
MISO  (via drill 0.3)
  Top 0.254: U8.13 75.01,14.65 v75.95,13.72 | v49.78,21.59 48.77,20.57 46.48,20.57 45.97,21.08 45.48,21.08 U6.13
  Bottom 0.254: v49.78,21.59 57.66,13.72 v75.95,13.72 76.45,13.72 78.49,11.68 JP4.6
MOSI  (via drill 0.3)
  Top 0.254: U6.12 44.85,21.59 46.99,21.59 v47.24,21.34 | U8.11 76,15.95 77.72,14.22 77.72,10.92 77.22,10.41 77.22,8.64 JP4.3
  Bottom 0.254: v47.24,21.34 47.24,21.08 56.64,11.68 73.41,11.68 74.68,10.41 74.68,8.64 JP4.3
N$1
  Top 0.254: R1.1 80.16,30.16 LED1.A
N$2
  Top 0.61: 100.08,54.1 96.77,54.1 96.14,53.47 Q3.3 | 100.08,54.1 100.33,53.85 | D2.C 100.08,56.67 100.08,54.1
  Top 0.813: R41.1 100.08,53.59 100.33,53.85
N$3
  Top 0.254: U6.4 36.73,22.52 R7.2
N$4
  Top 0.254: U6.5 37.25,21.9 R8.2
N$5
  Top 0.406: 100.84,46.73 R41.2
  Top 0.813: JP17.2 100.84,46.73
N$6
  Top 0.406: U2.15 27.65,55.84 28.19,56.39 30.48,56.39 30.99,56.9 30.99,60.71 29.97,61.72 29.33,61.72 FB4.P$1
N$7
  Top 0.254: R11.2 28.77,30.29 20.32,21.84 20.19,21.72 20.07,21.59 Q2.1
N$8
  Top 0.406: U2.19 25.05,56.23 24.13,57.15 FB2.P$1
N$9
  Top 0.508: U6.7 40.39,22.78 40.39,21.34 40.39,20.83 C11.2
N$10
  Top 0.406: FB3.P$2 JP9.3
N$11
  Top 0.254: U2.1 20.44,47.1 C5.2
N$12
  Top 0.254: U2.2 22.45,46.44 C5.1
N$13
  Top 0.254: U2.8 26.35,45.84 R2.1
N$14
  Top 0.406: U2.17 26.35,55.92 27.75,57.32 R17.1
N$15
  Top 0.406: R18.1 23.05,57.32 24.4,55.97 U2.20
N$16
  Top 0.406: U2.3 23.1,49.54 22.86,49.78 19.7,49.78 C4.2
N$17
  Top 0.406: FB4.P$2 JP9.4
N$18
  Top 0.813: FB20.P$2 35.44,67.96 JP13.1
N$19
  Top 0.254: C8.2 23.75,45.71 U2.4
N$20
  Top 0.406: FB1.P$1 21.45,61.98 20.83,61.98 19.81,60.96 19.81,56.9 20.32,56.39 22.35,56.39 23.11,55.63 23.1,55.61 U2.22
N$21
  Top 0.254: U2.7 25.7,49.45 25.91,49.66 26.67,49.66 26.92,49.4 26.92,48.54 U2.9 27,46.85 R4.2
N$22
  Top 0.508: U1.3 92.83,25.52 92.2,24.89 92.2,24.13 91.95,23.88 90.74,23.88 R38.1
  Top 0.813: R37.2 89.41,23.62 89.66,23.88 90.61,23.88 R38.1
N$23
  Top 0.406: U2.18 25.7,56.09 25.65,56.13 26.67,57.15 FB3.P$1
N$24
  Top 0.406: U3.18 46.02,56.18 46.99,57.15 FB7.P$1
N$25
  Top 0.406: U3.15 47.97,55.84 48.51,56.39 50.8,56.39 51.31,56.9 51.31,61.21 50.55,61.98 49.65,61.98 FB8.P$1
N$26
  Top 0.406: FB8.P$2 JP1.4
N$27
  Top 0.254: U2.5 24.4,44.47 22.35,42.42 18.8,42.42 18.41,42.8 MS-X.1
N$28
  Top 0.254: U2.6 25.05,44.35 22.61,41.91 18.54,41.91 16.76,43.69 16.71,43.74 16.64,43.81 MS-X.3
N$29
  Top 0.254: U3.1 40.89,47.24 40.89,46.37 C17.2
N$30
  Top 0.254: U3.2 42.77,46.44 C17.1
N$31
  Top 0.406: FB7.P$2 JP1.3
N$32
  Top 0.406: U3.20 44.72,55.99 43.37,57.34 R19.1
N$33
  Top 0.813: FB21.P$2 55.76,67.96 JP18.1
N$34
  Top 0.254: U3.8 46.67,45.72 46.6,45.65 R20.1
N$35
  Top 0.254: U3.4 44.07,45.09 43.18,44.2 C19.2
N$36
  Top 0.254: U3.7 46.02,49.45 46.23,49.66 47.12,49.66 47.32,49.45 U3.9 47.32,47.1 48.51,45.91 R22.2
N$37
  Top 0.254: 39.87,49.78 39.88,49.78 C21.2
  Top 0.406: U3.3 43.42,49.54 43.18,49.78 39.87,49.78
N$38
  Top 0.406: U3.17 46.67,55.94 48.07,57.34 R16.1
N$39
  Top 0.406: FB12.P$2 JP3.4
N$40
  Top 0.406: FB11.P$2 JP3.3
N$41
  Top 0.406: U3.19 45.37,56.23 44.45,57.15 FB6.P$1
N$42
  Top 0.254: U3.5 44.72,44.97 43.69,43.94 43.69,43.18 43.43,42.93 39.37,42.93 38.73,43.56 MS-Y.1
N$43
  Top 0.254: U3.6 45.37,44.86 44.2,43.69 44.2,42.93 43.69,42.42 37.59,42.42 36.96,43.05 MS-Y.3
N$44
  Top 0.254: U4.1 61.58,48.46 C22.2
N$45
  Top 0.254: U4.2 63.09,46.48 C22.1
N$46
  Top 0.406: U4.17 66.99,55.94 68.39,57.34 R24.1
N$47
  Top 0.406: U4.20 65.04,55.99 63.69,57.34 R25.1
N$48
  Top 0.813: R40.2 57.92,65.91 FB21.P$1
N$49
  Top 0.254: U4.8 66.99,45.65 R26.1
N$50
  Top 0.254: U4.4 64.39,44.58 64.26,44.45 C24.2
N$51
  Top 0.254: U4.7 66.34,49.45 66.55,49.66 67.44,49.66 67.64,49.45 U4.9 67.64,46.85 R28.2
N$52
  Top 0.457: U4.3 63.74,49.54 63.5,49.78 60.82,49.78
  Top 0.508: 60.82,49.78 60.31,49.78 C26.2
N$53
  Top 0.406: U3.22 43.42,55.64 42.67,56.39 40.64,56.39 40.13,56.9 40.13,61.21 40.89,61.98 41.79,61.98 FB5.P$1
N$54
  Top 0.406: FB16.P$2 JP5.4
N$55
  Top 0.406: FB15.P$2 JP5.3
N$56
  Top 0.406: U4.18 66.34,56.18 67.31,57.15 FB11.P$1
N$57
  Top 0.254: U4.5 65.04,43.96 64.26,43.18 59.18,43.18 58.8,43.56 MS-Z.1
N$58
  Top 0.254: U4.6 65.69,43.59 64.64,42.55 57.91,42.55 57.02,43.43 MS-Z.3
N$59
  Top 0.254: U5.1 81.9,47.61 C27.2
N$60
  Top 0.254: U5.2 83.41,46.48 C27.1
N$61
  Top 0.406: U5.17 87.31,55.94 88.71,57.34 R30.1
N$62
  Top 0.406: U5.20 85.36,55.94 84.07,57.23 84.07,58.61
  Top 0.457: 84.07,58.61 R31.1
N$63
  Top 0.254: R39.2 37.6,63.75 37.59,63.75 37.59,65.65 FB20.P$1
N$64
  Top 0.254: U5.8 87.31,45.72 R32.1
N$65
  Top 0.254: U5.4 84.71,44.58 84.58,44.45 C29.2
N$66
  Top 0.254: U5.7 86.66,49.45 86.87,49.66 87.76,49.66 87.96,49.45 U5.9 87.96,47.1 R34.2
N$67
  Top 0.356: U5.3 84.06,49.54 83.82,49.78 81.4,49.78 C31.2
N$68
  Top 0.406: U4.15 68.29,55.59 69.09,56.39 70.87,56.39 71.63,57.15 71.63,61.21 70.75,62.09 FB12.P$1 69.86,62.08
N$69
  pour Top: 5.33,51.82 5.33,57.96 8.38,57.96 8.38,63.75 0.51,63.75 0.51,70.87 11.94,70.87 11.94,51.82
N$70
  pour Top: 1.02,51.82 4.57,51.82 4.57,52.07 4.57,58.93 7.62,58.93 7.62,62.99 0.51,62.99 0.51,62.74 0.51,51.82
N$71
  Top 0.254: Q1.1 15.24,32.26 16,31.5 16,30.29 R36.2
N$72
  Top 0.254: U5.5 85.36,43.7 84.58,42.93 80.01,42.93 79.12,43.81 MS-E.1
N$73
  Top 0.254: U5.6 86.01,43.34 85.09,42.42 78.23,42.42 77.34,43.31 MS-E.3
N$74
  Top 0.406: FB2.P$2 JP9.2
N$75
  Top 0.254: U1.6 94.6,27.67 94.36,27.43 94.36,25.27 95.13,24.5 C2.1
  Top 0.61: 93.47,30.73 L1.P$1 | 93.47,30.73 95.5,28.7 95.5,27.74 U1.6 | D1.C 89.88,27.15 93.47,30.73
N$76
  Top 0.406: FB1.P$2 JP9.1
N$77
  Top 0.254: U1.1 93.62,27.67 93.85,27.43 93.85,25.27 93.33,24.75 C2.2
N$78
  Top 0.406: U4.19 65.69,56.23 64.77,57.15 FB10.P$1
N$79
  Top 0.406: FB9.P$1 60.45,60.31 60.45,57.4 61.47,56.39 62.99,56.39 63.75,55.63 63.74,55.61 U4.22
N$80
  Top 0.305: U5.18 86.66,56.08 87.68,57.1 87.68,57.56 87.63,57.61
  Top 0.406: 87.63,57.61 FB15.P$1
N$81
  Top 0.406: U5.15 88.61,55.84 89.15,56.39 90.68,56.39 91.95,57.66 91.95,61.47 91.32,62.09 FB16.P$1
N$82
  Top 0.406: U5.19 86.01,56.13 84.94,57.2 84.94,57.61 85.09,57.76 FB14.P$1
N$83
  Top 0.406: FB13.P$1 82.43,61.98 81.79,61.98 80.77,60.96 80.77,57.15 81.53,56.39 83.31,56.39 84.07,55.63 84.06,55.61 U5.22
N$84
  Top 0.406: FB14.P$2 JP5.2
N$85
  Top 0.406: FB13.P$2 JP5.1
N$86
  Top 0.406: FB10.P$2 JP3.2
N$87
  Top 0.406: FB9.P$2 JP3.1
N$88
  Top 0.406: FB6.P$2 JP1.2
N$89
  Top 0.406: FB5.P$2 JP1.1
N$90
  Top 0.406: JP12.1 31.6,3.3 FB17.P$2
N$91
  Top 0.305: FB18.P$2 JP8.1
N$92
  Top 0.305: FB19.P$2 JP10.1
PB5  (via drill 0.3)
  Top 0.254: U6.15 45.47,18.81 45.47,18.29 48.51,15.24 v48.51,10.92
  Bottom 0.254: JP2.1 50.55,7.37 48.51,9.4 v48.51,10.92
PB6  (via drill 0.3)
  Top 0.254: U6.16 49.53,15.89 v49.53,11.43
  Bottom 0.254: JP2.11 64.52,8.64 50.8,8.64 49.53,9.91 v49.53,11.43
PC0
  Top 0.254: JP11.12 67.82,34.29 66.04,32.51 58.04,32.51 U6.35
PC1
  Top 0.254: JP11.13 65.53,37.85 66.55,36.83 66.55,34.29 65.28,33.02 57.41,33.02 U6.36
PC2
  Top 0.254: U6.37 56.79,33.53 63.5,33.53 JP11.14
PD2-RX1
  Top 0.254: 55.91,23.37 61.47,23.37 64.77,20.07 64.77,15.75 59.44,10.41 59.44,8.64 JP2.5 | U6.27 55.91,23.37 | 55.91,23.37
PD3-TX1
  Top 0.254: 56.54,23.88 61.72,23.88 66.8,18.8 66.8,15.24 61.98,10.41 61.98,8.64 JP2.7 | U6.28 56.54,23.88 | 56.54,23.88
PD4
  Top 0.254: 56.65,24.89 59.18,24.89 62.61,28.32 72.26,28.32 76.71,32.77 76.71,36.83 75.69,37.85 JP11.5 | U6.29 56.65,24.89 | 56.65,24.89
PD5
  Top 0.254: 57.28,25.4 58.42,25.4 61.98,28.96 71.37,28.96 75.44,33.02 JP11.6 | U6.30 57.28,25.4 | 57.28,25.4
PD6
  Top 0.254: 57.65,26.16 58.17,26.16 61.59,29.59 70.74,29.59 74.17,33.02 74.17,36.83 73.15,37.85 JP11.7 | U6.31 57.65,26.16 | 57.65,26.16
PD7
  Top 0.254: 60.56,30.23 69.34,30.23 72.9,33.78 JP11.8 | U6.32 60.56,30.23 | 60.56,30.23
PE0  (via drill 0.3)
  Top 0.254: JP11.10 70.36,34.04 67.75,31.43 59.22,31.43 U6.33 59.06,29.85 v59.18,29.97 | v62.48,26.67 62.48,26.16 67.06,21.59 68.07,21.59 69.6,20.07 69.6,10.92 v70.1,10.41 | v45.47,7.62 43.49,7.62 USBPWR1.1
  Bottom 0.254: v59.18,29.97 v62.48,26.67 | v70.1,10.41 70.1,4.57 69.85,4.32 50.55,4.32 49.28,5.59 47.5,5.59 v45.47,7.62
PE1
  Top 0.254: 58.66,32 66.8,32 69.09,34.29 69.09,36.83 68.07,37.85 JP11.11 | U6.34 58.66,32 | 58.66,32
PE5  (via drill 0.3)
  Top 0.254: U6.19 51.05,19.18 51.05,7.62 50.8,7.37 v50.8,6.6
  Bottom 0.254: JP2.3 54.1,5.84 51.56,5.84 v50.8,6.6
SCL  (via drill 0.3)
  Top 0.254: U6.25 52.89,24.13 51.82,24.13 v51.05,24.89 | U10.2 35.44,37.96 | 35.44,37.96 36.07,37.34 36.07,35.56 v36.32,35.31 | 35.44,37.96 35.44,37.98 36.83,39.37 36.83,39.94 R5.1
  Bottom 0.254: v36.32,35.31 39.37,32.26 43.69,32.26 v51.05,24.89 51.05,24.64 49.28,22.86 46.99,22.86 39.62,15.49 37.85,15.49 36.96,14.61 JP7.1
SCLK  (via drill 0.3)
  Top 0.254: U8.12 75.88,15.3 77.22,13.97 77.22,11.18 JP4.4 | U6.11 44.23,22.1 47.5,22.1 v48.26,21.34
  Bottom 0.254: v48.26,21.34 48.26,20.83 56.9,12.19 73.66,12.19 JP4.4
SDA  (via drill 0.3)
  Top 0.254: U6.26 53.51,24.64 53.09,24.64 52.58,25.15 v52.32,25.15 | U10.3 35.18,37.46 35.56,37.08 35.56,34.8 | 35.56,34.8 35.81,34.54 v38.1,34.54 | R15.1 35.05,35.31 35.56,34.8
  Bottom 0.254: v38.1,34.54 39.62,33.02 44.45,33.02 v52.32,25.15 49.53,22.35 47.24,22.35 39.5,14.61 JP7.2
SDCD  (via drill 0.3)
  Top 0.254: 49.78,17.27 v49.53,17.27 49.78,17.53 49.78,18.19 U6.17 | J1.CD2 93.36,17.4 v93.09,17.14 | v52.58,14.22 53.34,13.46 56.13,13.46 57.91,15.24 v58.93,15.24
  Bottom 0.254: v49.53,17.27 50.29,17.27 52.58,14.99 v52.58,14.22 | v93.09,17.14 91.44,18.8 73.15,18.8 72.52,18.16 69.09,14.73 59.44,14.73 v58.93,15.24
SDCLK  (via drill 0.3)
  Top 0.254: J1.5 88.52,8.77 87.38,9.91 83.31,9.91 81.53,11.68 v81.53,14.99 81.22,15.3 U8.3
SDCS  (via drill 0.3)
  Top 0.254: v52.58,12.7 56.39,12.7 v58.17,14.48 | U8.10 72.23,16.6 v72.14,16.51 | v46.48,12.7 46.48,15.24 42.16,19.56 42.16,21.16 U6.10
  Bottom 0.254: v46.48,12.7 v52.58,12.7 | v72.14,16.51 69.85,14.22 58.42,14.22 v58.17,14.48
SDCSH  (via drill 0.3)
  Top 0.254: J1.2 91.82,8.51 89.41,10.92 83.82,10.92 82.8,11.94 82.8,16.26 v82.3,16.76 81.28,16.76 81.12,16.6 U8.5
SDDI  (via drill 0.3)
  Top 0.254: J1.3 90.72,8.85 89.15,10.41 83.57,10.41 82.3,11.68 82.3,15.49 81.84,15.95 81.79,15.95 | U8.4 81.79,15.95 | v81.79,16 81.79,15.95
SDDO  (via drill 0.3)
  Top 0.254: J1.7 86.32,8.68 85.6,9.4 83.06,9.4 80.9,11.56 80.9,12.19 | U8.2 80.73,14.65 80.9,14.48 80.9,12.19 | v80.52,12.19 80.9,12.19
TCK  (via drill 0.3)
  Top 0.254: U6.57 46.93,28.96 v54.61,28.96 | JP2.6 64.01,15.75 v64.01,17.27
  Bottom 0.254: v64.01,17.27 64.01,20.07 55.12,28.96 v54.61,28.96
TDI  (via drill 0.3)
  Top 0.254: v53.59,30.73 49.28,30.73 48.51,31.5 47.79,31.5 U6.54 | JP2.12 68.33,12.45 v68.33,18.54
  Bottom 0.254: v53.59,30.73 54.86,30.73 67.06,18.54 v68.33,18.54
TDO  (via drill 0.3)
  Top 0.254: v67.56,20.32 67.56,16 67.56,15.75 67.56,14.22 JP2.10 | 47.67,30.48 v48.01,30.48 47.67,30.48 | U6.55 47.67,30.48
  Bottom 0.254: v67.56,20.32 66.04,20.32 54.61,31.75 51.82,31.75 50.55,30.48 v48.01,30.48
TMS  (via drill 0.3)
  Top 0.254: v51.82,29.72 51.56,29.46 47.56,29.46 | 47.56,29.46 | U6.56 47.56,29.46 | JP2.8 65.53,14.73 v65.53,18.8
  Bottom 0.254: v65.53,18.8 64.52,19.81 64.52,20.32 55.12,29.72 v51.82,29.72
VBUS  (via drill 0.3)
  Top 0.254: U6.8 42.67,23.93 42.67,24.38 40.26,26.8 39.88,26.8 U6.3 36.96,23.88 31.54,23.88 C14.1 31.37,24.01 31.37,24 | U$12.+ 16.58,13.9 16.51,13.97
  Top 0.305: 29.72,24.13 USBPWR.1 29.66,22.8 28.7,21.84 23.88,21.84 16.26,14.22 16.51,13.97 19.05,13.97 | U9.5 19.05,13.97 | v19.05,13.72 19.05,13.97
  Top 0.406: C14.1 31.29,24.13 29.72,24.13
VREF_E  (via drill 0.3)
  Top 0.254: U5.12 92,48.46 94.49,45.97 94.49,44.7 94.88,44.31 C41.1 | v92.71,41.91 95.5,41.91 96.77,43.18 C41.1 | C41.1 96.77,44.45 | U10.6 39.48,36.47 v39.62,36.32
  Bottom 0.254: v92.71,41.91 92.2,41.4 77.98,41.4 76.96,42.42 76.2,42.42 75.69,41.91 45.21,41.91 v39.62,36.32
VREF_X  (via drill 0.3)
  Top 0.254: U2.12 30.53,48.46 30.99,48.01 C39.1 32.12,46.87 32.51,46.48 v33.02,46.48 | U10.9 38.73,37.96 39.12,38.35 v39.12,40.39
  Bottom 0.254: v33.02,46.48 33.02,44.7 34.29,43.43 36.58,43.43 39.12,40.89 v39.12,40.39
VREF_Y  (via drill 0.3)
  Top 0.254: U3.12 51.11,48.46 51.82,47.75 C38.1 52.69,46.62 53.09,46.23 53.59,46.23 54.36,45.47 v54.36,43.94 | U10.8 38.99,37.46 39.88,38.35 v39.88,38.61
  Bottom 0.254: v54.36,43.94 54.36,43.69 53.59,42.93 43.18,42.93 39.88,39.62 v39.88,38.61
VREF_Z  (via drill 0.3)
  Top 0.254: v74.68,42.93 74.68,44.96 74.42,45.21 C40.1 72.27,47.11 70.92,48.46 U4.12 | U10.7 39.51,36.97 40.89,38.35 v40.89,38.61
  Bottom 0.254: v74.68,42.93 74.17,42.42 43.43,42.42 40.64,39.62 40.64,38.86 v40.89,38.61
X-DIR
  Top 0.254: U2.14 28.3,55.48 28.7,55.88 30.99,55.88 31.5,55.37 31.5,51.05 32.51,50.04 35.05,50.04 35.05,45.97 34.54,45.47 34.54,42.67 35.31,41.91 41.9,41.91 U6.50
X-STEP
  Top 0.254: U2.11 28.3,47.39 28.45,47.24 30.73,47.24 34.04,43.94 34.04,42.42 35.05,41.4 41.28,41.4 U6.51
X-STOP
  Top 0.254: U6.9 41.4,21.53 41.4,18.8 38.35,15.75 35.81,15.75 35.31,15.24 35.31,12.45 34.29,11.43
  Top 0.305: 34.29,11.43 31.75,11.43
  Top 0.406: FB17.P$1 31.75,9.03 31.75,11.43
XTAL1
  Top 0.254: U6.24 53.79,22.1 54.1,22.1 54.61,22.61 57.4,22.61 57.91,22.1 C44.2 59.58,20.56 X1.P$1
XTAL2
  Top 0.254: U6.23 53.85,20.91 53.85,19.05 54.36,18.54 54.36,18.29 | 54.36,18.29 54.61,18.29 55.12,17.78 56.13,17.78 56.64,17.27 56.64,17.02 X1.P$2 | C43.2 54.36,18.29
Y-DIR
  Top 0.254: U3.14 48.62,55.48 49.02,55.88 51.56,55.88 52.07,55.37 52.07,50.8 52.58,50.29 54.86,50.29 55.63,49.53 55.63,44.2 54.36,42.93 53.34,42.93 52.07,41.66 50.8,41.66 49.78,40.64 49.78,38.96 U6.48
Y-STEP
  Top 0.254: U3.11 48.62,47.39 48.77,47.24 51.05,47.24 52.58,45.72 53.34,45.72 53.59,45.47 53.59,43.94 51.82,42.16 50.55,42.16 46.72,38.33 | 46.72,38.33 | 46.72,38.33 U6.49
Y-STOP
  Top 0.254: U6.14 44.7,19.18 44.7,18.29 47.75,15.24 47.75,12.19 45.97,10.41 43.43,10.41 USBPWR2.2 USBPWR2.1 USBPWR1.2 41.66,8.58 41.66,8.89 39.37,8.89 FB18.P$1
Z-DIR
  Top 0.254: U4.14 68.94,55.48 69.22,55.75 73.41,55.75 73.66,55.5 73.66,54.61 73.91,54.36 75.18,54.36 75.69,53.85 75.69,42.04 74.93,41.27 54.36,41.27 U6.46
Z-STEP
  Top 0.254: U4.11 68.94,47.39 69.09,47.24 71.37,47.24 73.91,44.7 73.91,42.29 73.53,41.91 53.86,41.91 U6.47
Z-STOP
  Top 0.254: U6.18 50.55,18.55 50.55,10.92
  Top 0.305: FB19.P$1 48.65,9.03 50.55,10.92

## Text on the board
tPlace: 12V | GND | Pirxboard A | based on Printrboard | pirx3D.com | Laine Walker-Avina (C) 2013 | CC-BY-SA
tNames: Reset
_tsilk: C6 | C16 | C18 | C23 | R24 | X-MOT | Y-MOT | R16 | Z-MOT | E-MOT | R18 | R17 | R19 | R25 | R31 | R30 | C28 | C33 | C35 | C37 | D2 | U2 | U3 | U4 | U5 | Q3 | F1 | C21 | C26 | C31 | C4 | R3 | C39 | C38 | R14 | C17 | C5 | R21 | R27 | C22 | C40 | R33 | C27 | MS-X | MS-Y | MS-Z | MS-E | C8 | R2 | R4 | C15 | C19 | R20 | R22 | C20 | C24 | R26 | R28 | C25 | C29 | R32 | R34 | C30 | C41 | R5 | PWR | R13 | FAN | C42 | C7 | C13 | L1 | U10 | T-EXT | HOTEND | Q1 | BOOT | R15 | C3 | EXP2 | R36 | U6 | R11 | R35 | C34 | R1 | C1 | 5V | U1 | D1 | C12 | R6 | R9 | C9 | C44 | R37 | T-BED | C10 | USBPWR | C14 | R7 | R38 | C43 | R10 | C2 | R8 | C11 | C32 | X1 | U7 | Reset | Printrboard | Rev. F | printrbot.com | Laine Walker-Avina (C) 2013 | CC-BY-SA | I2C | R12 | U9 | C36 | U8 | HOTBED | Q2 | Y-STOP | X-STOP | EXP1 | ICSP | J1 | USB | Z-STOP
122bmp: /home/ceriand/Downloads/pbrd-logo.bmp